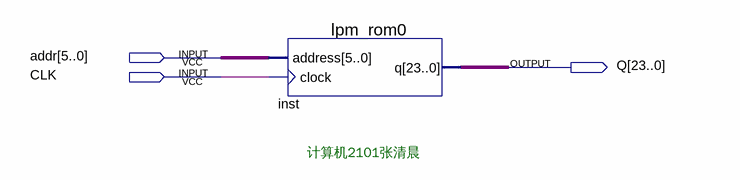
[diagram p0: schematic sheet]
// Quartus schematic ROM.bdf as structural Verilog: 1 symbols, 3 pins
module ROM (
  input  [5:0] addr,
  input  CLK,
  output [23:0] Q
);

  lpm_rom0 inst (.address(addr), .clock(CLK), .q(Q));

  // Notes on the sheet:
  //   计算机2101张清晨
endmodule
